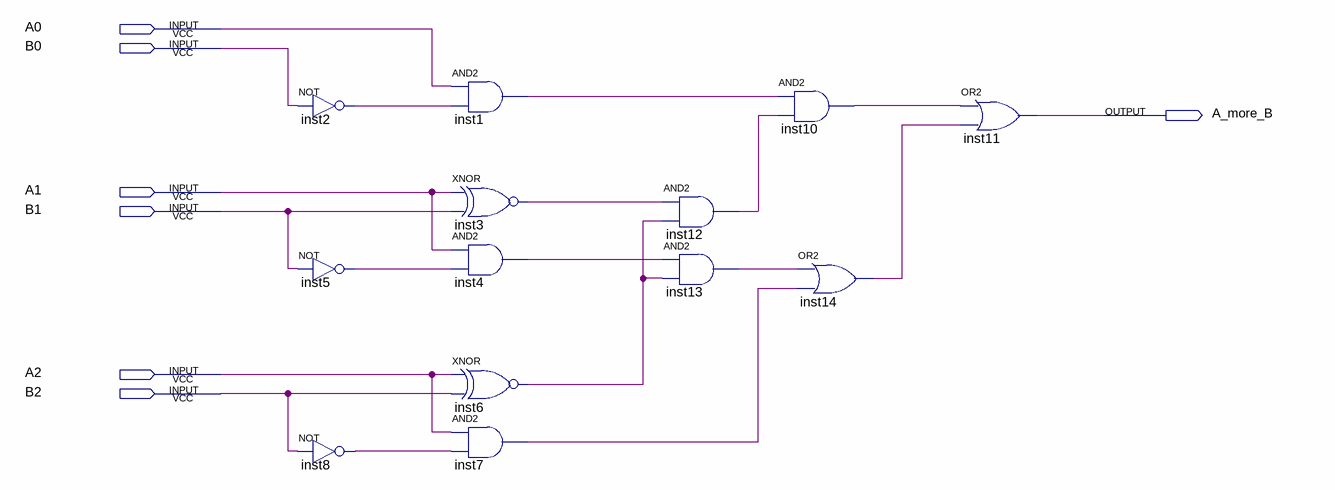
[diagram p0: schematic sheet]
// Quartus schematic praca5.bdf as structural Verilog: 13 symbols, 7 pins
module praca5 (
  input  A0,
  input  B0,
  input  A1,
  input  B1,
  input  A2,
  input  B2,
  output A_more_B
);

  wire inst1_out, inst2_out, inst3_out, inst4_out, inst5_out, inst6_out, inst7_out, inst8_out, inst10_out,
       inst12_out, inst13_out, inst14_out;

  not inst2 (inst2_out, B0);
  not inst5 (inst5_out, B1);
  not inst8 (inst8_out, B2);
  and inst1 (inst1_out, A0, inst2_out);
  xnor inst3 (inst3_out, A1, B1);
  and inst4 (inst4_out, A1, inst5_out);
  xnor inst6 (inst6_out, A2, B2);
  and inst7 (inst7_out, A2, inst8_out);
  and inst12 (inst12_out, inst3_out, inst6_out);
  and inst13 (inst13_out, inst4_out, inst6_out);
  and inst10 (inst10_out, inst1_out, inst12_out);
  or inst14 (inst14_out, inst13_out, inst7_out);
  or inst11 (A_more_B, inst10_out, inst14_out);
endmodule
